# EAGLE design DuoSerialToI2C (EAGLE 6.4)
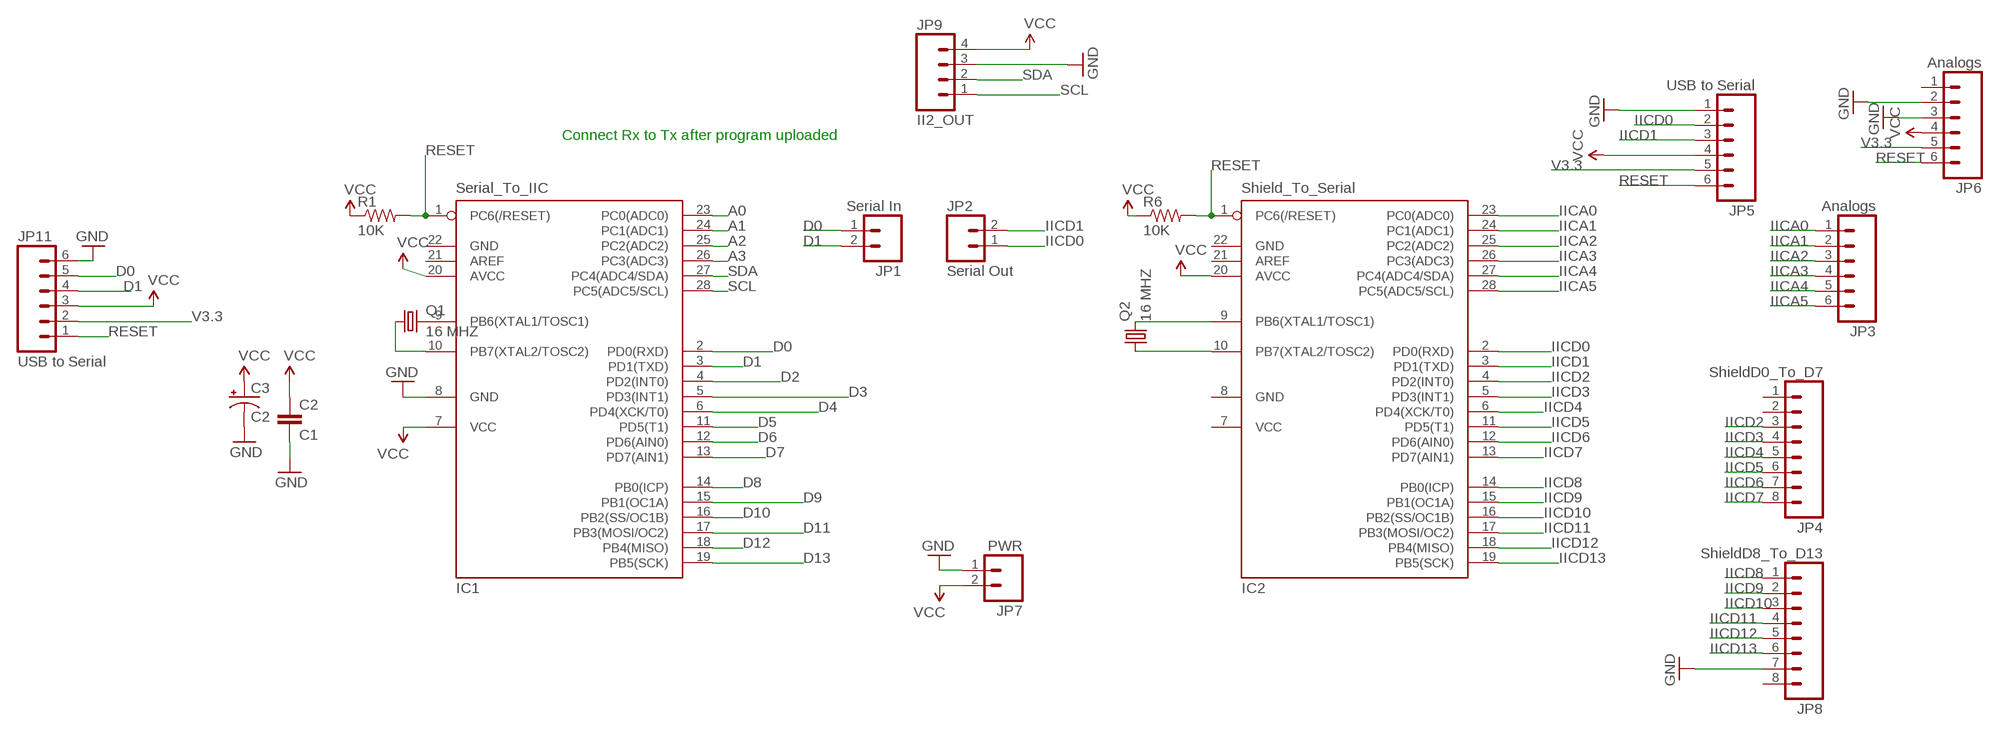
[diagram p0: schematic, sheet 1]

## Parts
C2  C1  CAPPTH  [CAP-PTH-SMALL]
C3  C2  CAP_POLPTH1  [CPOL-RADIAL-100UF-25V]
IC1  Serial_To_IIC  MEGA8-P  [DIL28-3]
IC2  Shield_To_Serial  MEGA8-P  [DIL28-3]
JP1  Serial In  M02PTH  [1X02]
JP2  Serial Out  M02PTH  [1X02]
JP3  Analogs  M06SIP  [1X06]
JP4  ShieldD0_To_D7  M08  [1X08]
JP5  USB to Serial  M06SIP  [1X06]
JP6  Analogs  M06SIP  [1X06]
JP7  PWR  M02PTH  [1X02]
JP8  ShieldD8_To_D13  M08  [1X08]
JP9  II2_OUT  M04LONGPADS  [1X04_LONGPADS]
JP11  USB to Serial  M06SIP  [1X06]
Q1  16 MHZ  CRYSTALHC49US  [HC49US]
Q2  16 MHZ  CRYSTALHC49US  [HC49US]
R1  10K  RESISTORPTH1  [AXIAL-0.3]
R6  10K  RESISTORPTH1  [AXIAL-0.3]

## Nets
A0: IC1.23(PC0(ADC0))
A1: IC1.24(PC1(ADC1))
A2: IC1.25(PC2(ADC2))
A3: IC1.26(PC3(ADC3))
D0: IC1.2(PD0(RXD)) JP1.1 JP11.5
D1: IC1.3(PD1(TXD)) JP1.2 JP11.4
D2: IC1.4(PD2(INT0))
D3: IC1.5(PD3(INT1))
D4: IC1.6(PD4(XCK/T0))
D5: IC1.11(PD5(T1))
D6: IC1.12(PD6(AIN0))
D7: IC1.13(PD7(AIN1))
D8: IC1.14(PB0(ICP))
D9: IC1.15(PB1(OC1A))
D10: IC1.16(PB2(SS/OC1B))
D11: IC1.17(PB3(MOSI/OC2))
D12: IC1.18(PB4(MISO))
D13: IC1.19(PB5(SCK))
GND: C2.2 C3.2(-) IC1.8(GND) JP5.1 JP6.2 JP6.3 JP7.1 JP8.7 JP9.3 JP11.6
IICA0: IC2.23(PC0(ADC0)) JP3.1
IICA1: IC2.24(PC1(ADC1)) JP3.2
IICA2: IC2.25(PC2(ADC2)) JP3.3
IICA3: IC2.26(PC3(ADC3)) JP3.4
IICA4: IC2.27(PC4(ADC4/SDA)) JP3.5
IICA5: IC2.28(PC5(ADC5/SCL)) JP3.6
IICD0: IC2.2(PD0(RXD)) JP2.1 JP5.2
IICD1: IC2.3(PD1(TXD)) JP2.2 JP5.3
IICD2: IC2.4(PD2(INT0)) JP4.3
IICD3: IC2.5(PD3(INT1)) JP4.4
IICD4: IC2.6(PD4(XCK/T0)) JP4.5
IICD5: IC2.11(PD5(T1)) JP4.6
IICD6: IC2.12(PD6(AIN0)) JP4.7
IICD7: IC2.13(PD7(AIN1)) JP4.8
IICD8: IC2.14(PB0(ICP)) JP8.1
IICD9: IC2.15(PB1(OC1A)) JP8.2
IICD10: IC2.16(PB2(SS/OC1B)) JP8.3
IICD11: IC2.17(PB3(MOSI/OC2)) JP8.4
IICD12: IC2.18(PB4(MISO)) JP8.5
IICD13: IC2.19(PB5(SCK)) JP8.6
N$1: IC2.9(PB6(XTAL1/TOSC1)) Q2.2
N$5: IC2.10(PB7(XTAL2/TOSC2)) Q2.1
N$6: IC1.9(PB6(XTAL1/TOSC1)) Q1.2
N$7: IC1.10(PB7(XTAL2/TOSC2)) Q1.1
RESET: IC1.1(PC6(/RESET)) IC2.1(PC6(/RESET)) JP5.6 JP6.6 JP11.1 R1.P$2 R6.P$2
SCL: IC1.28(PC5(ADC5/SCL)) JP9.1
SDA: IC1.27(PC4(ADC4/SDA)) JP9.2
V3.3: JP5.5 JP6.5 JP11.2
VCC: C2.1 C3.1(+) IC1.7(VCC) IC1.20(AVCC) IC2.20(AVCC) JP5.4 JP6.4 JP7.2 JP9.4 JP11.3 R1.P$1 R6.P$1
Unconnected: IC1.21(AREF) IC2.21(AREF) JP4.1 JP4.2 JP6.1 JP8.8

## Notes on the sheet
- Connect Rx to Tx after program uploaded

## Power pins joined to a net without a drawn wire
GND: IC1.22(GND) IC2.8(GND) IC2.22(GND)
VCC: IC2.7(VCC)

## Library data of the parts
C2 = SparkFun:CAP: Capacitor Standard 0603 ceramic capacitor, and 0.1" leaded capacitor.
C3 = SparkFun:CAP_POL: Capacitor Polarized These are standard SMD and PTH capacitors. Normally 10uF, 47uF, and 100uF in electrolytic and tantalum varieties. Always verify the external diameter of the through hole cap, it varies with capacity, voltage, and manufacturer. The EIA devices should be standard.
IC1 IC2 = atmel:MEGA8-P: MICROCONTROLLER 8 Kbytes FLASH, 1 kbytes SRAM, 512 bytes EEPROM, USART, 4-channel 10 bit ADC, 2-channel 8 bit ADC Pin compatible with Atmega48, ATMega88, ATMega168 Source: avr.lbr; OC_FARNELL: unknown; OC_NEWARK: unknown
JP1 JP2 JP7 = SparkFun:M02: Header 2 Standard 2-pin 0.1" header. Use with straight break away headers (SKU : PRT-00116), right angle break away headers (PRT-00553), swiss pins (PRT-00743), machine pins (PRT-00117), and female headers (PRT-00115). Molex polarized connector foot print use with SKU : PRT-08233 with associated crimp pins and housings.
JP3 JP5 JP6 JP11 = SparkFun:M06: Header 6 Standard 6-pin 0.1" header. Use with straight break away headers (SKU : PRT-00116), right angle break away headers (PRT-00553), swiss pins (PRT-00743), machine pins (PRT-00117), and female headers (PRT-00115). Molex polarized connector foot print use with SKU : PRT-08094 with associated crimp pins and housings. NOTES ON THE VARIANTS LOCK and LOCK_LONGPADS... This footprint was designed to help hold the alignment of a through-hole component (i.e. 6-pin header) while soldering it into place. You may notice that each hole has been shifted either up or down by 0.005 of an inch from it's more standard position (which is a perfectly straight line). This slight alteration caused the pins (the squares in the middle) to touch the edges of the holes. Because they are alternating, it causes a "brace" to hold the component in place. 0.005 has proven to be the perfect amount of "off-center" position when using our standard breakaway headers. Although looks a little odd when you look at the bare footprint, once you have a header in there, the alteration is very hard to notice. Also, if you push a header all the way into place, it is covered up entirely on the bottom side. This idea of altering the position of holes to aid alignment will be further integrated into the Sparkfun Library for other footprints. It can help hold any component with 3 or more connection pins.
JP4 JP8 = SparkFun:M08: Header 8 Standard 8-pin 0.1" header. Use with straight break away headers (SKU : PRT-00116), right angle break away headers (PRT-00553), swiss pins (PRT-00743), machine pins (PRT-00117), and female headers (PRT-00115).
JP9 = SparkFun-Connectors:M04: Header 4 Standard 4-pin 0.1" header. Use with straight break away headers (SKU : PRT-00116), right angle break away headers (PRT-00553), swiss pins (PRT-00743), machine pins (PRT-00117), and female headers (PRT-00115). Molex polarized connector foot print use with SKU : PRT-08231 with associated crimp pins and housings. 1MM SMD Version SKU: PRT-10208
Q1 Q2 = SparkFun:CRYSTAL: Crystals Various standard crystals. Proven footprints. Spark Fun Electronics SKU : COM-00534
R1 R6 = SparkFun:RESISTOR: Resistor Basic schematic elements and footprints for 0603, 1206, and PTH 1/10th watt (small) resistors.

## Board
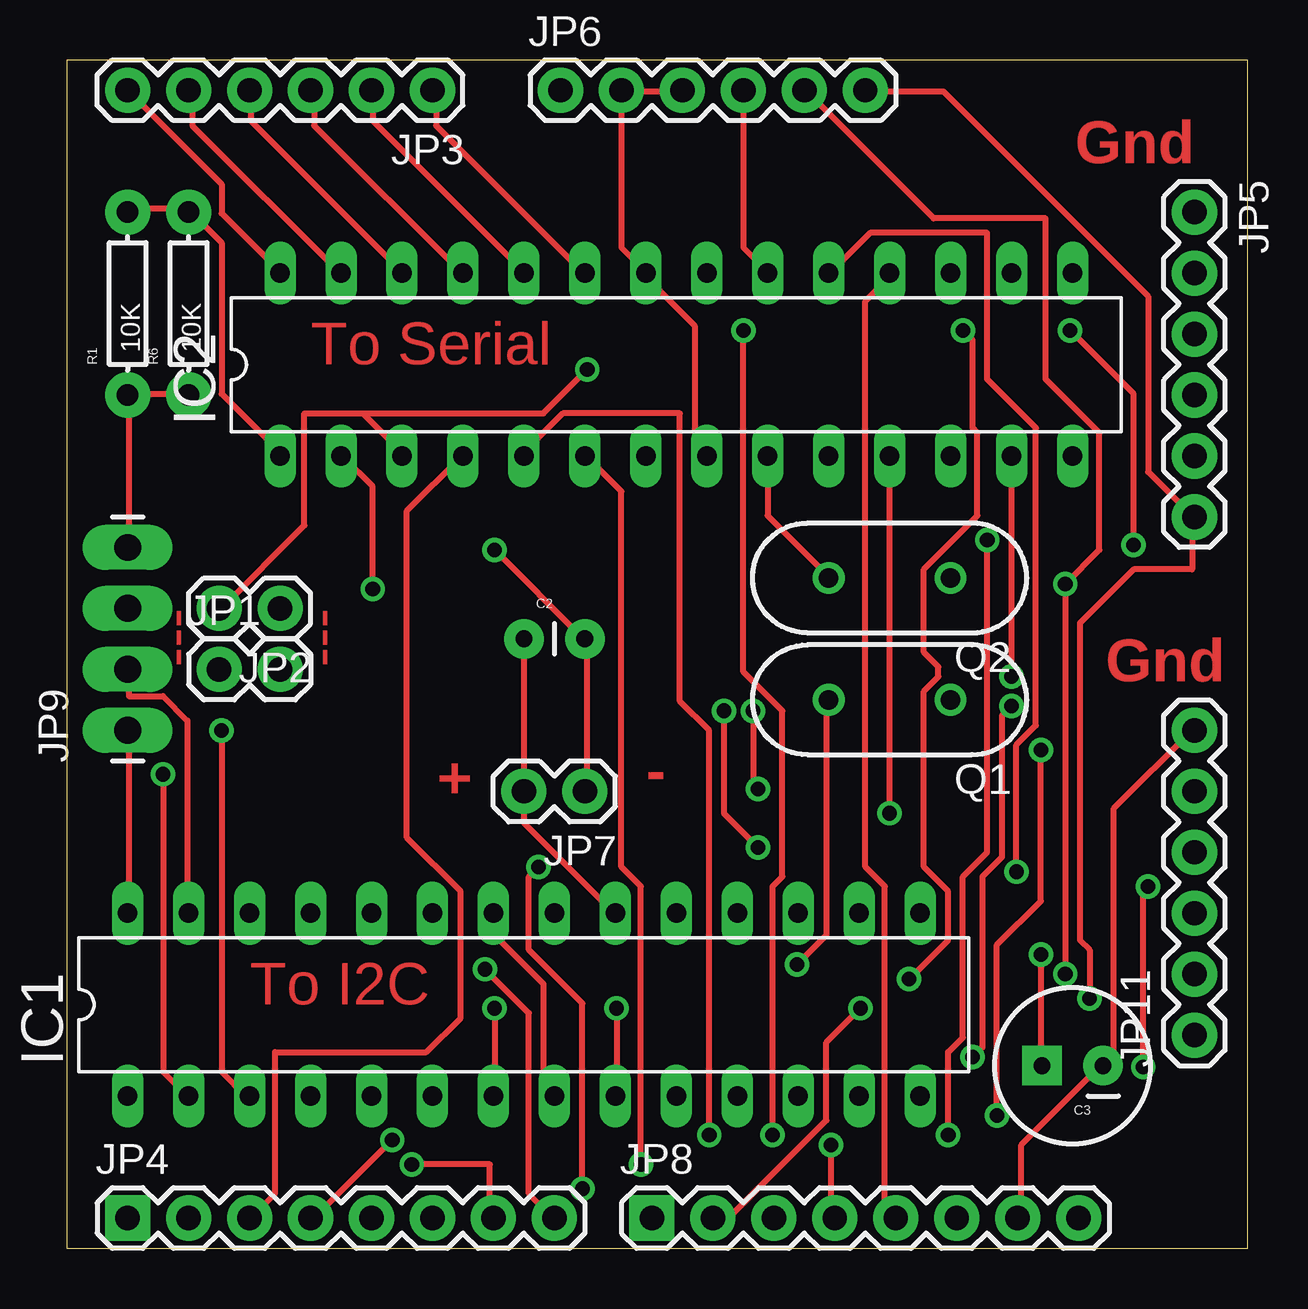
[diagram p1: board, top side]
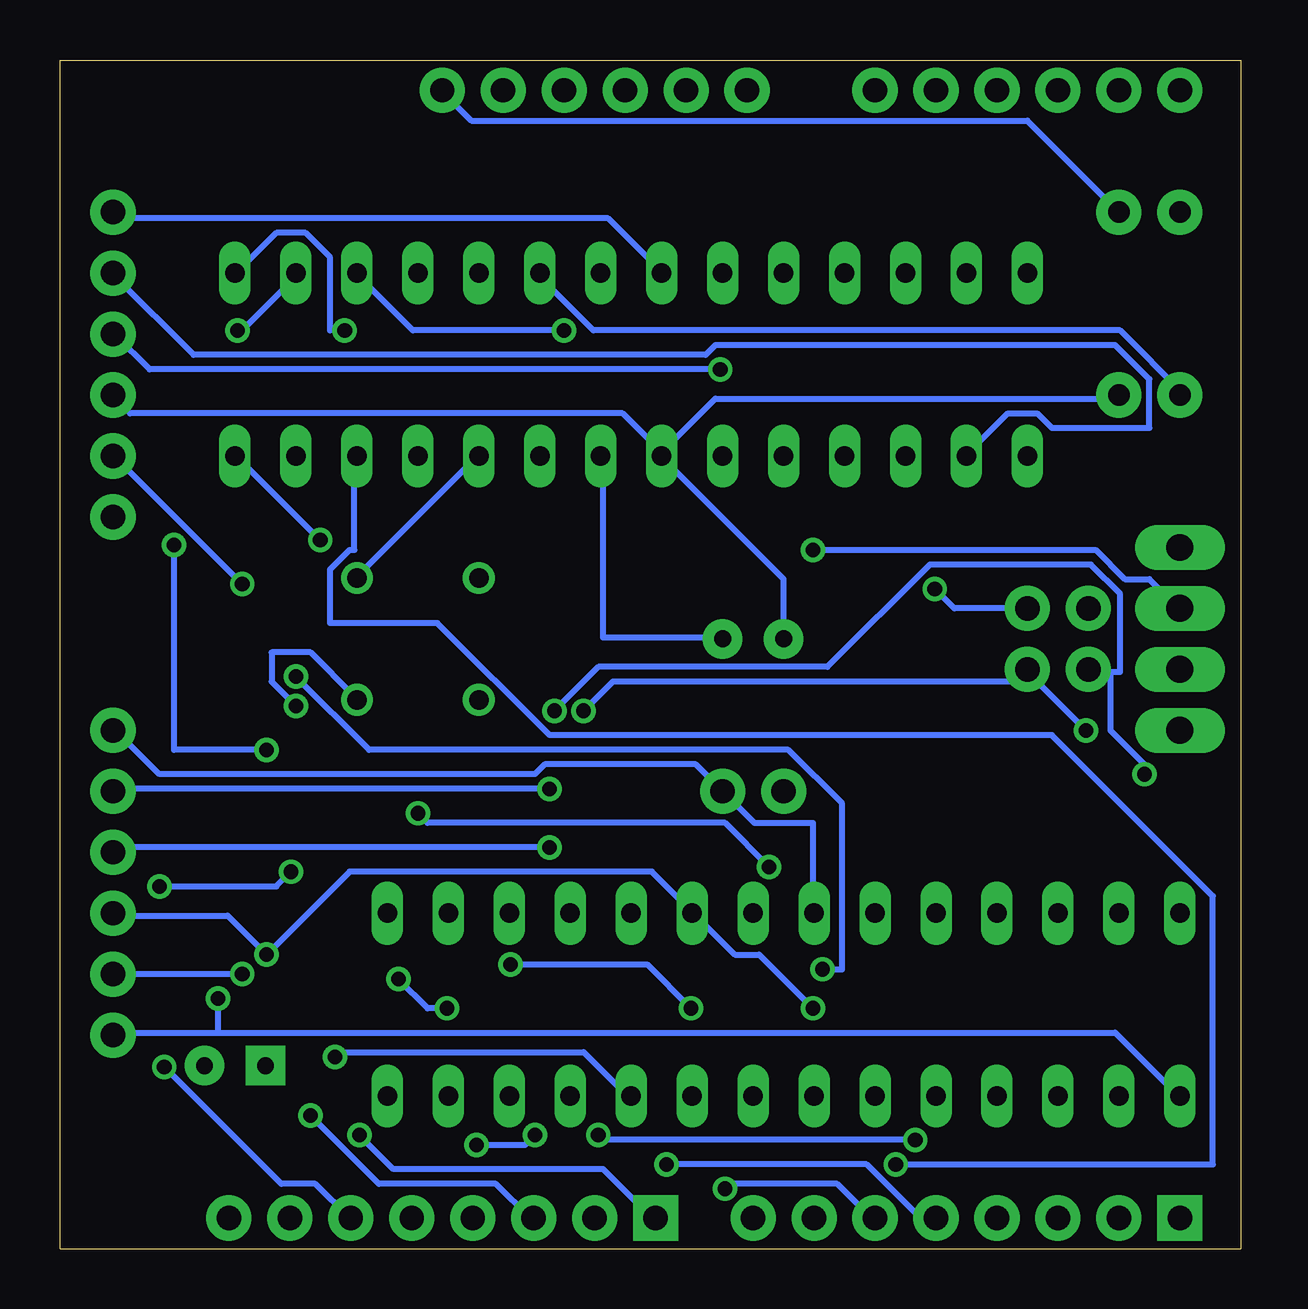
[diagram p2: board, bottom side, seen from below]

Size 49.2 x 49.53 mm. Coordinates in mm from the lower left corner, seen from the top.
Outline: 49.2,0 49.2,49.53 0,49.53 0,0 49.2,0
Copper layers (1*16): Top 0.035mm / dielectric 1.5mm / Bottom 0.035mm
Design rules "default": minimum track width 10mil, minimum drill 24mil, track to track 8mil, track to pad 8mil, pad to pad 8mil, via to via 8mil, smd to smd 8mil, copper to edge 40mil, drill to drill 8mil, minimum pad ring 10mil, minimum via ring 8mil, stop-mask expansion 4mil, vias tented up to drill 0mil, thermal gap 10mil

### Footprints (pad centres in the part's own frame; a part is rotated, then mirrored left to right if it is on the bottom)
CAP-PTH-SMALL = drill 0.7 pad 1.651: 1 0,0; 2 2.54,0
CPOL-RADIAL-100UF-25V = drill 0.7 pad 1.651 square: 1 1.27,0 | drill 0.7 pad 1.651: 2 -1.27,0
DIL28-3 = drill 0.813 long: 1 -16.51,-3.81; 2 -13.97,-3.81; 3 -11.43,-3.81; 4 -8.89,-3.81; 5 -6.35,-3.81; 6 -3.81,-3.81; 7 -1.27,-3.81; 8 1.27,-3.81; 9 3.81,-3.81; 10 6.35,-3.81; 11 8.89,-3.81; 12 11.43,-3.81; 13 13.97,-3.81; 14 16.51,-3.81; 15 16.51,3.81; 16 13.97,3.81; 17 11.43,3.81; 18 8.89,3.81; 19 6.35,3.81; 20 3.81,3.81; 21 1.27,3.81; 22 -1.27,3.81; 23 -3.81,3.81; 24 -6.35,3.81; 25 -8.89,3.81; 26 -11.43,3.81; 27 -13.97,3.81; 28 -16.51,3.81
1X02 = drill 1.016 pad 1.88: 1 0,0; 2 2.54,0
1X06 = drill 1.016 pad 1.88: 1 0,0; 2 2.54,0; 3 5.08,0; 4 7.62,0; 5 10.16,0; 6 12.7,0
1X08 = drill 1.016 pad 1.88 square: 1 0,0 | drill 1.016 pad 1.88: 2 2.54,0; 3 5.08,0; 4 7.62,0; 5 10.16,0; 6 12.7,0; 7 15.24,0; 8 17.78,0
1X04_LONGPADS = drill 1.118 pad 1.88 long: 1 0,0; 2 2.54,0; 3 5.08,0; 4 7.62,0
HC49US = drill 0.813: 1 -2.54,0; 2 2.54,0
AXIAL-0.3 = drill 0.9 pad 1.88: P$1 -3.81,0; P$2 3.81,0

### Placement (x,y rotation side)
C2  19.05,25.41 0 top
C3  41.91,7.63 180 top
IC1  19.05,10.17 0 top
IC2  25.4,36.84 0 top
JP1  6.35,24.14 0 top
JP2  8.89,26.68 180 top
JP3  15.24,48.27 180 top
JP4  2.54,1.28 0 top
JP5  46.99,43.19 270 top
JP6  20.57,48.27 0 top
JP7  21.59,19.06 180 top
JP8  24.38,1.28 0 top
JP9  2.54,21.6 90 top
JP11  46.99,8.9 90 top
Q1  34.29,22.87 180 top
Q2  34.29,27.95 180 top
R1  2.54,39.38 90 top
R6  5.08,39.38 90 top

### Tracks (layer width: path | path; a pad name or v marks a point on that pad's centre or on a via)
D0  (via drill 0.61)
  Top 0.254: v4.01,19.77 4.01,7.38 5.03,6.36 IC1.2 | v28.8,19.16 28.6,19.37 v28.6,22.41
  Bottom 0.254: v4.01,19.77 4.01,20.18 5.44,21.6 5.44,24.04 | 5.44,24.04 6.25,24.04 JP1.1 5.44,24.04 | v28.8,19.16 46.89,19.16 JP11.5 | v28.6,22.41 26.77,24.24 17.22,24.24 12.95,28.51 6.25,28.51 5.03,27.29 5.03,24.04 5.44,24.04
D1  (via drill 0.61)
  Top 0.254: v6.45,21.6 6.45,7.38 7.47,6.36 IC1.3 | v28.8,16.72 27.38,18.15 v27.38,22.41
  Bottom 0.254: 8.48,23.63 8.89,24.04 JP1.2 8.48,23.63 | 8.48,23.63 v6.45,21.6 | v28.8,16.72 46.69,16.72 46.89,16.52 JP11.4 | v27.38,22.41 26.16,23.63 8.48,23.63
GND  (via drill 0.61)
  Top 0.254: 23.11,48.22 23.11,41.72 24.13,40.7 IC2.22 24.13,40.5 26.16,38.47 26.16,33.59 26.57,33.18 IC2.8 | 23.11,48.22 25.55,48.22 JP6.3 | 23.11,48.22 JP6.2 | JP8.7 39.78,1.28 39.78,4.33 43.03,7.58 C3.2 43.23,7.78 43.64,8.19 43.64,18.35 46.89,21.6 JP11.6 | IC1.8 20.27,6.36 19.86,6.77 19.86,11.03 17.83,13.07 17.83,13.88 IC1.22 | JP7.1 21.69,19.16 21.69,25.26 C2.2 21.49,25.46 v17.83,29.12
  Bottom 0.254: JP5.1 46.89,43.14 46.69,42.94 26.36,42.94 24.13,40.7 IC2.22 | IC1.22 17.83,14.08 17.83,17.74 20.27,17.74 JP7.1 22.71,20.18 29.01,20.18 29.41,19.77 45.06,19.77 46.89,21.6 JP11.6 | v17.83,29.12 6.05,29.12 4.83,27.9 3.81,27.9 2.59,26.68 JP9.3 | IC2.8 26.57,32.98 26.57,25.46 21.69,25.46 C2.2
IICA0
  Top 0.254: IC2.23 21.49,40.7 15.39,46.8 15.39,48.22 JP3.1
IICA1
  Top 0.254: IC2.24 19.05,40.7 12.75,47 12.75,48.22 JP3.2
IICA2
  Top 0.254: IC2.25 16.41,40.7 10.31,46.8 10.31,48.22 JP3.3
IICA3
  Top 0.254: IC2.26 13.97,40.7 7.67,47 7.67,48.22 JP3.4
IICA4
  Top 0.254: IC2.27 11.33,40.7 5.23,46.8 5.23,48.22 JP3.5
IICA5
  Top 0.254: JP3.6 6.45,44.36 6.45,43.14 8.89,40.7 IC2.28
IICD0  (via drill 0.61)
  Top 0.254: v12.75,27.49 12.75,31.76 11.53,32.98 IC2.2
  Bottom 0.254: v12.75,27.49 11.94,26.68 JP2.1 | JP5.2 46.89,40.5 43.64,37.25 22.3,37.25 21.89,37.65 5.23,37.65 3.81,36.23 3.81,34.2 7.87,34.2 8.48,34.81 9.7,34.81 11.33,33.18 IC2.2
IICD1  (via drill 0.61)
  Top 0.254: 12.34,34.81 13.97,33.18 IC2.3 | 12.34,34.81 9.91,34.81 9.91,30.13 6.45,26.68 JP2.2 | v21.69,36.64 19.86,34.81 12.34,34.81
  Bottom 0.254: v21.69,36.64 45.47,36.64 46.89,38.06 JP5.3
IICD2
  Top 0.254: IC2.4 16.41,32.98 14.17,30.74 14.17,17.13 16.41,14.89 16.41,9.61 14.99,8.19 8.69,8.19 8.69,2.3 7.67,1.28 JP4.3
IICD3  (via drill 0.61)
  Top 0.254: v26.77,4.73 26.77,21.6 25.55,22.82 25.55,34.81 20.68,34.81 19.05,33.18 IC2.5 | v13.56,4.53 10.31,1.28 JP4.4
  Bottom 0.254: v26.77,4.73 26.57,4.53 v13.56,4.53
IICD4  (via drill 0.61)
  Top 0.254: v23.93,3.52 23.93,15.1 23.11,15.91 23.11,31.56 21.69,32.98 IC2.6
  Bottom 0.254: v23.93,3.52 15.6,3.52 13.36,1.28 JP4.5
IICD5  (via drill 0.61)
  Top 0.254: v34.29,18.15 IC2.11 | v19.66,15.91 19.25,15.5 19.25,12.46 21.49,10.22 v21.49,2.5
  Bottom 0.254: v34.29,18.15 33.88,17.74 21.49,17.74 v19.66,15.91 | v21.49,2.5 21.28,2.7 16.81,2.7 15.39,1.28 JP4.6
IICD6  (via drill 0.61)
  Top 0.254: v14.38,3.52 17.63,3.52 17.63,1.28 JP4.7
  Bottom 0.254: v14.38,3.52 1.17,3.52 1.17,14.69 7.87,21.4 28.8,21.4 33.48,26.07 37.95,26.07 37.95,28.31 37.13,29.12 36.93,29.12 36.93,32.98 IC2.12
IICD7  (via drill 0.61)
  Top 0.254: v39.37,23.84 IC2.13 | v17.42,11.64 19.25,9.81 19.25,2.3 20.27,1.28 JP4.8
  Bottom 0.254: v39.37,23.84 36.32,20.79 18.85,20.79 16.61,18.55 16.61,11.64 v17.42,11.64
IICD8  (via drill 0.61)
  Top 0.254: v38.35,29.52 38.35,16.52 37.34,15.5 37.34,8.8 36.73,8.19 v36.73,4.73
  Bottom 0.254: v38.35,29.52 41.81,32.98 IC2.14 | v36.73,4.73 35.31,3.31 26.57,3.31 24.54,1.28 JP8.1
IICD9  (via drill 0.61)
  Top 0.254: v37.34,38.26 37.74,37.86 37.74,34.2 37.95,33.99 37.95,30.54 35.71,28.31 35.71,24.85 36.32,24.24 36.32,23.84 35.71,23.23 35.71,15.91 36.73,14.89 36.73,12.86 v35.1,11.24 | v33.07,10.02 31.65,8.6 31.65,5.34 27.58,1.28 JP8.2
  Bottom 0.254: v37.34,38.26 37.95,38.26 37.95,41.31 38.96,42.33 40.18,42.33 41.81,40.7 IC2.15 | v35.1,11.24 33.88,10.02 v33.07,10.02
IICD10  (via drill 0.61)
  Top 0.254: v41.81,38.26 44.45,35.62 v44.45,29.32 | v40.59,20.79 40.59,14.49 38.76,12.66 v38.76,5.55
  Bottom 0.254: v41.81,38.26 41.61,38.26 39.37,40.5 IC2.16 | v44.45,29.32 44.45,20.79 v40.59,20.79 | v38.76,5.55 35.92,2.7 31.04,2.7 29.62,1.28 JP8.3
IICD11  (via drill 0.61)
  Top 0.254: v28.19,38.26 28.19,24.04 29.82,22.41 29.82,15.5 29.41,15.1 v29.41,4.73 | v31.85,4.33 31.85,1.28 JP8.4
  Bottom 0.254: v28.19,38.26 34.49,38.26 36.73,40.5 IC2.17 | v29.41,4.73 29.82,4.33 v31.85,4.33
IICD12
  Top 0.254: IC2.18 34.29,40.5 33.27,39.48 33.27,15.91 34.09,15.1 34.09,1.69 34.49,1.28 JP8.5
IICD13  (via drill 0.61)
  Top 0.254: v39.57,15.71 39.57,20.99 40.39,21.8 40.39,34.2 38.35,36.23 38.35,42.33 33.48,42.33 31.85,40.7 IC2.19 | v45.06,15.1 44.86,14.89 v44.86,7.58
  Bottom 0.254: v39.57,15.71 40.18,15.1 v45.06,15.1 | v44.86,7.58 39.98,2.7 38.56,2.7 37.13,1.28 JP8.6
N$1
  Top 0.254: IC2.9 29.21,30.54 31.65,28.1 Q2.2
N$5
  Bottom 0.254: IC2.10 31.85,32.98 36.73,28.1 Q2.1
N$6  (via drill 0.61)
  Top 0.254: v22.91,10.02 22.91,6.36 IC1.9 | v30.43,11.85 31.65,13.07 31.65,22.82 Q1.2
  Bottom 0.254: v22.91,10.02 24.74,11.85 v30.43,11.85
N$7  (via drill 0.61)
  Top 0.254: v37.74,7.99 38.15,8.39 38.15,15.5 38.96,16.32 38.96,22.21 v39.37,22.62
  Bottom 0.254: v37.74,7.99 37.54,8.19 27.38,8.19 25.55,6.36 IC1.10 | v39.37,22.62 40.39,23.63 40.39,24.85 38.76,24.85 36.93,23.02 Q1.1
RESET  (via drill 0.61)
  Top 0.254: IC2.1 8.89,33.18 6.45,35.62 6.45,41.92 5.23,43.14 R6.P$2 5.03,43.34 2.59,43.34 R1.P$2 | JP6.6 33.27,48.22 36.52,48.22 45.06,39.69 45.06,32.37 46.89,30.54 JP5.6 46.89,30.34 46.89,28.31 44.45,28.31 42.22,26.07 42.22,12.86 42.62,12.46 v42.62,10.42
  Bottom 0.254: 42.62,9 46.89,9 JP11.1 | 42.62,9 5.23,9 2.59,6.36 IC1.1 | R6.P$2 8.89,47 32.05,47 33.27,48.22 JP6.6 | v42.62,10.42 42.62,9
SCL
  Top 0.254: IC1.28 2.59,14.08 2.59,21.6 JP9.1
SDA
  Top 0.254: IC1.27 5.03,14.08 5.03,22.01 4.01,23.02 2.59,23.02 2.59,24.04 JP9.2
V3.3  (via drill 0.61)
  Top 0.254: v41.61,11.44 v41.61,27.7 43.03,29.12 43.03,33.99 40.79,36.23 40.79,42.94 36.12,42.94 30.84,48.22 JP6.5
  Bottom 0.254: v41.61,11.44 JP11.2 | v41.61,27.7 46.89,32.98 JP5.5
VCC  (via drill 0.61)
  Top 0.254: JP6.4 28.19,41.72 29.21,40.7 IC2.20 | JP9.4 2.59,29.32 2.59,35.42 R1.P$1 2.59,35.62 5.03,35.62 R6.P$1 | v40.59,12.25 40.59,7.78 C3.1 | v17.83,10.02 17.83,6.36 IC1.7 | C2.1 JP7.2 19.05,17.74 22.71,14.08 IC1.20
  Bottom 0.254: IC2.20 29.21,40.5 26.98,38.26 5.03,38.26 2.39,35.62 R1.P$1 | JP11.3 46.89,13.88 42.22,13.88 v40.59,12.25 37.13,15.71 24.54,15.71 22.91,14.08 IC1.20 22.71,13.88 21.08,12.25 20.07,12.25 v17.83,10.02 | C2.1 19.05,27.9 24.13,32.98 IC2.7 24.13,33.18 | 24.13,33.18 25.76,34.81 46.28,34.81 46.89,35.42 JP5.4 | 24.13,33.18 21.89,35.42 5.23,35.42 R6.P$1

### Text on the board
Top: Gnd | To Serial | --- | --- | Gnd | + | - | To I2C